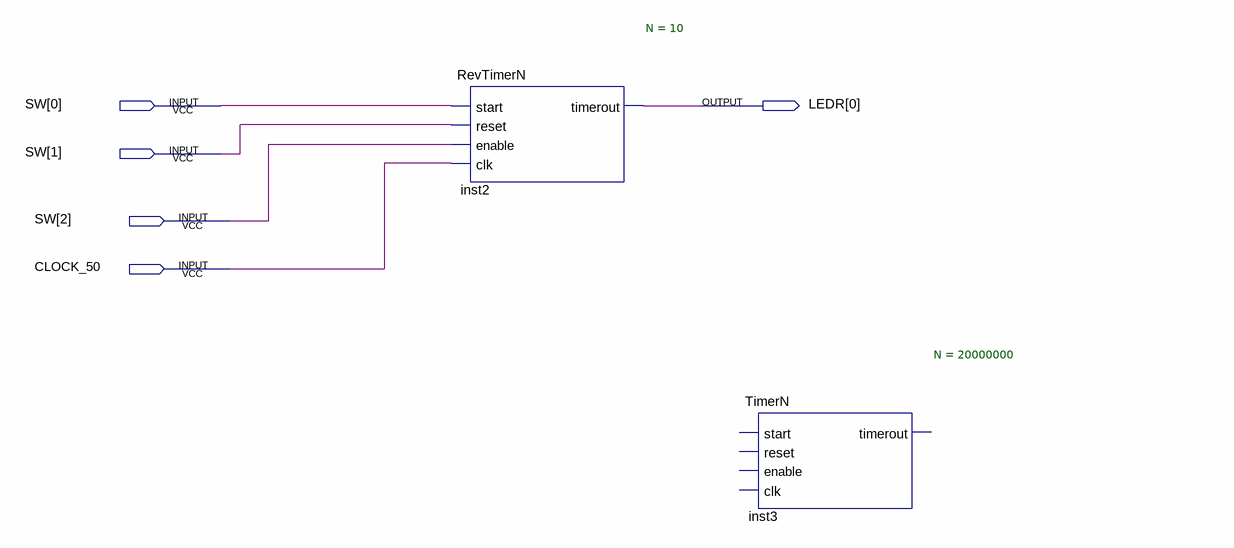
[diagram p0: schematic sheet]
// Quartus schematic TimerN_Demo.bdf as structural Verilog: 2 symbols, 5 pins
module TimerN_Demo (
  input  [2:0] SW,
  input  CLOCK_50,
  output [0:0] LEDR
);

  RevTimerN #(.N(10)) inst2 (.start(SW[0]), .reset(SW[1]), .enable(SW[2]), .clk(CLOCK_50), .timerout(LEDR[0]));
  TimerN #(.N(20000000)) inst3 ();  // open: start, reset, enable, clk, timerout
endmodule
